# EAGLE design xwoofer (EAGLE 6.4)
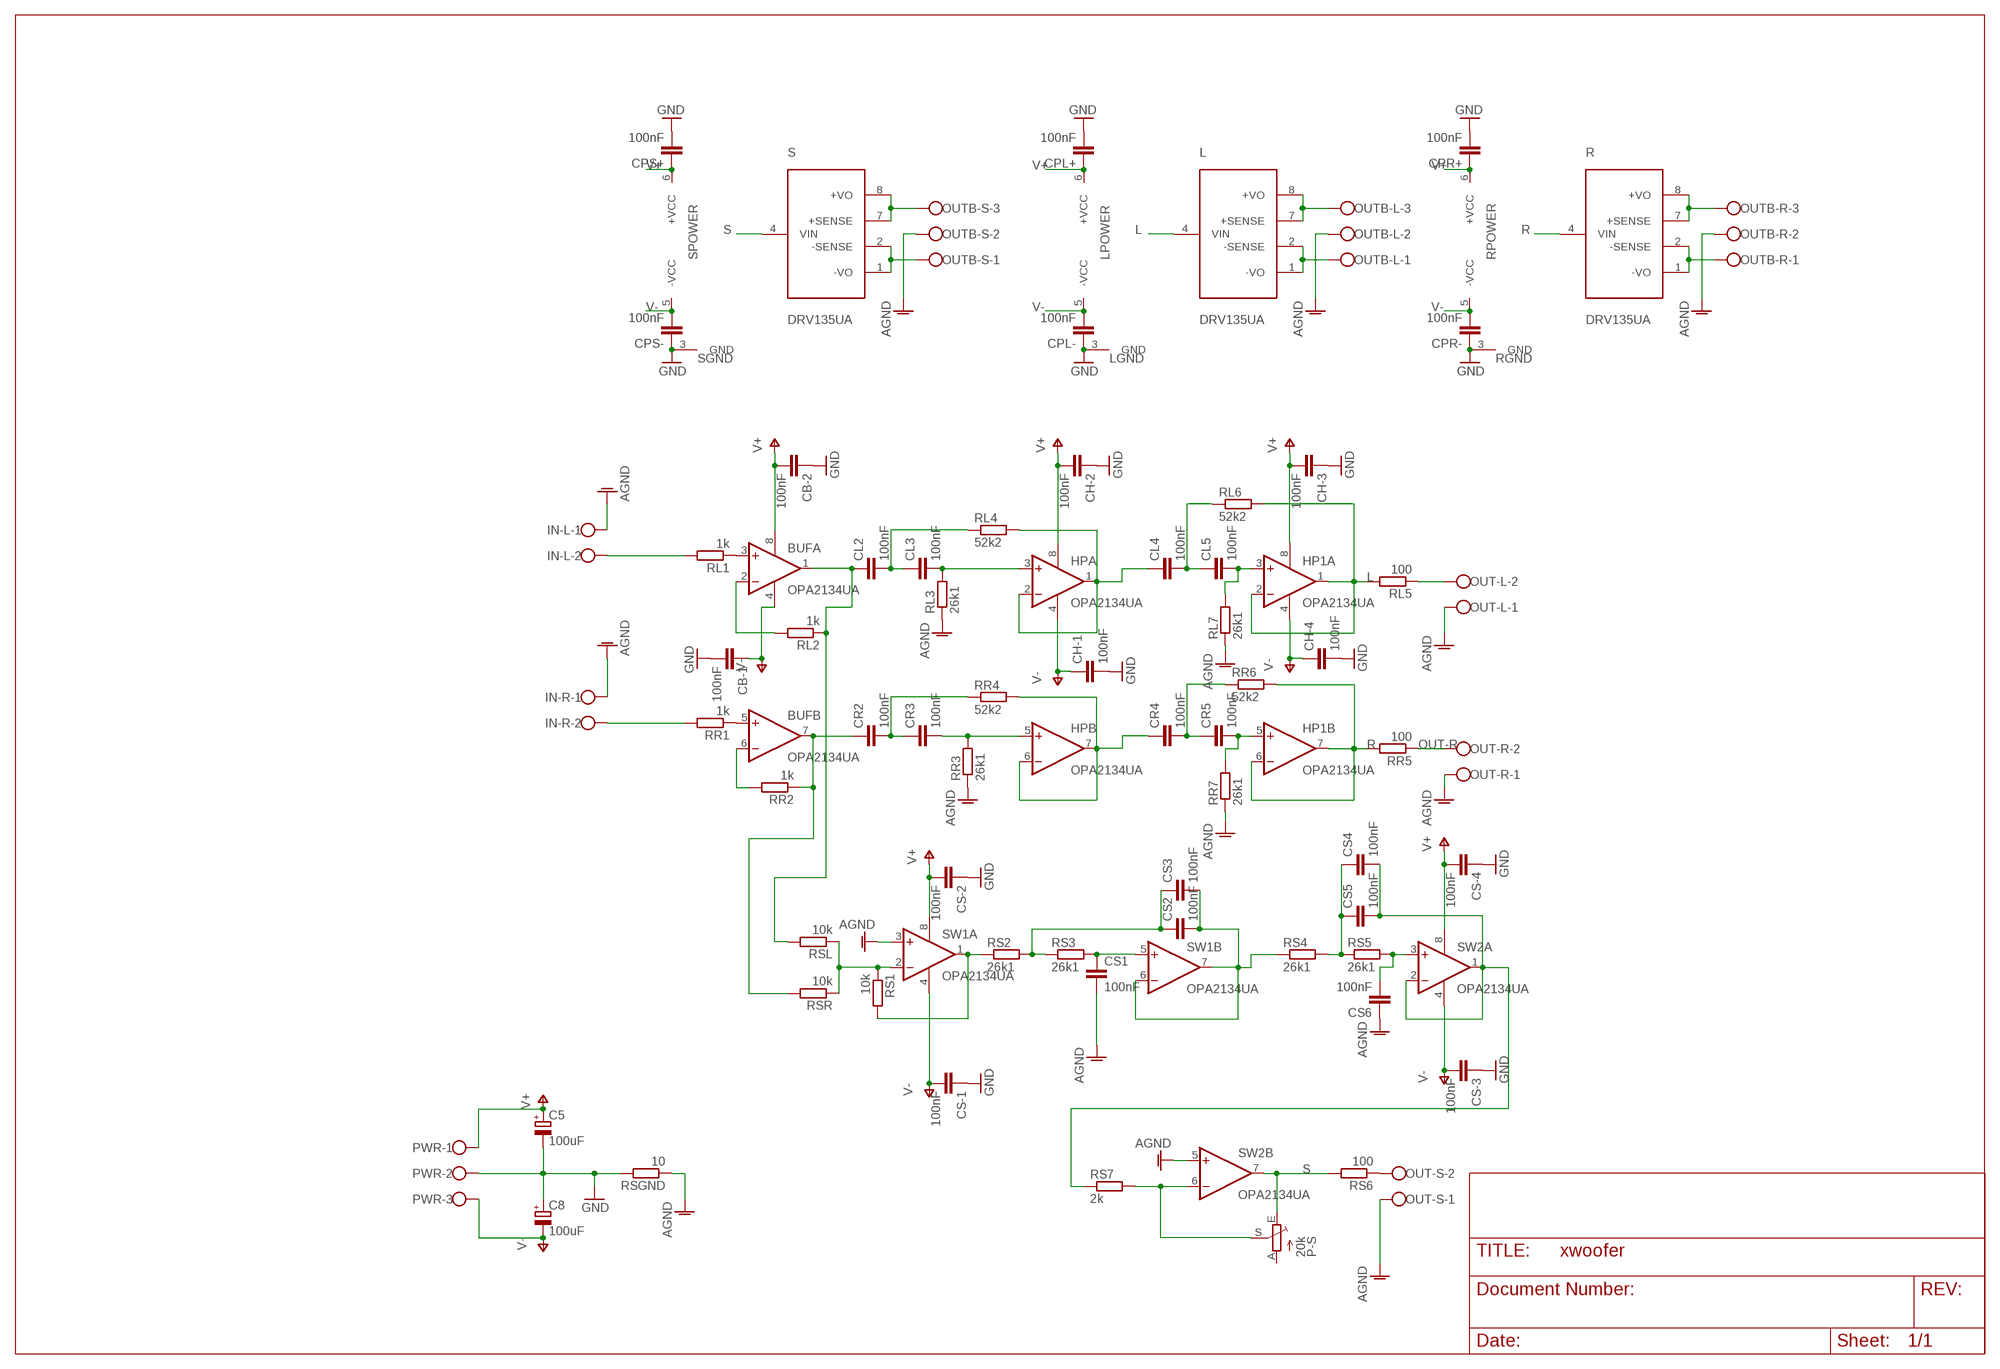
[diagram p0: schematic, sheet 1]

## Parts
BUF  OPA2134UA  [SO08]
C5  100uF  CPOL-EUE2.5-7  [E2,5-7]
C8  100uF  CPOL-EUE2.5-7  [E2,5-7]
CB-1  100nF  C-EUC0805  [C0805]
CB-2  100nF  C-EUC0805  [C0805]
CH-1  100nF  C-EUC0805K  [C0805K]
CH-2  100nF  C-EUC0805K  [C0805K]
CH-3  100nF  C-EUC0805K  [C0805K]
CH-4  100nF  C-EUC0805K  [C0805K]
CL2  100nF  C-EU025-025X050  [C025-025X050]
CL3  100nF  C-EU025-025X050  [C025-025X050]
CL4  100nF  C-EU025-025X050  [C025-025X050]
CL5  100nF  C-EU025-025X050  [C025-025X050]
CPL+  100nF  C-EUC0805K  [C0805K]
CPL-  100nF  C-EUC0805K  [C0805K]
CPR+  100nF  C-EUC0805K  [C0805K]
CPR-  100nF  C-EUC0805K  [C0805K]
CPS+  100nF  C-EUC0805K  [C0805K]
CPS-  100nF  C-EUC0805K  [C0805K]
CR2  100nF  C-EU025-025X050  [C025-025X050]
CR3  100nF  C-EU025-025X050  [C025-025X050]
CR4  100nF  C-EU025-025X050  [C025-025X050]
CR5  100nF  C-EU025-025X050  [C025-025X050]
CS1  100nF  C-EU025-025X050  [C025-025X050]
CS2  100nF  C-EU025-025X050  [C025-025X050]
CS3  100nF  C-EU025-025X050  [C025-025X050]
CS4  100nF  C-EU025-025X050  [C025-025X050]
CS5  100nF  C-EU025-025X050  [C025-025X050]
CS6  100nF  C-EU025-025X050  [C025-025X050]
CS-1  100nF  C-EUC0805K  [C0805K]
CS-2  100nF  C-EUC0805K  [C0805K]
CS-3  100nF  C-EUC0805K  [C0805K]
CS-4  100nF  C-EUC0805K  [C0805K]
HP  OPA2134UA  [SO08]
HP1  OPA2134UA  [SO08]
IN-L  W237-102  [W237-102]
IN-R  W237-102  [W237-102]
L  DRV135UA  [SO08]
OUT-L  W237-102  [W237-102]
OUT-R  W237-102  [W237-102]
OUT-S  W237-102  [W237-102]
OUTB-L  W237-103  [W237-103]
OUTB-R  W237-103  [W237-103]
OUTB-S  W237-103  [W237-103]
P-S  20k  TRIM_EU-B64Y  [B64Y]
PWR  W237-103  [W237-103]
R  DRV135UA  [SO08]
RL1  1k  R-EU_R0603  [R0603]
RL2  1k  R-EU_R0603  [R0603]
RL3  26k1  R-EU_R0603  [R0603]
RL4  52k2  R-EU_R0603  [R0603]
RL5  100  R-EU_R1206  [R1206]
RL6  52k2  R-EU_R0603  [R0603]
RL7  26k1  R-EU_R0603  [R0603]
RR1  1k  R-EU_R0603  [R0603]
RR2  1k  R-EU_R0603  [R0603]
RR3  26k1  R-EU_R0603  [R0603]
RR4  52k2  R-EU_R0603  [R0603]
RR5  100  R-EU_R1206  [R1206]
RR6  52k2  R-EU_R0603  [R0603]
RR7  26k1  R-EU_R0603  [R0603]
RS1  10k  R-EU_R0603  [R0603]
RS2  26k1  R-EU_R0603  [R0603]
RS3  26k1  R-EU_R0603  [R0603]
RS4  26k1  R-EU_R0603  [R0603]
RS5  26k1  R-EU_R0603  [R0603]
RS6  100  R-EU_R1206  [R1206]
RS7  2k  R-EU_R0603  [R0603]
RSGND  10  R-EU_R1206  [R1206]
RSL  10k  R-EU_R0603  [R0603]
RSR  10k  R-EU_R0603  [R0603]
S  DRV135UA  [SO08]
SW1  OPA2134UA  [SO08]
SW2  OPA2134UA  [SO08]

## Nets
AGND: CS1.2 CS6.1 IN-L.1 IN-R.1 OUT-L.1 OUT-R.1 OUT-S.1 OUTB-L.2 OUTB-R.2 OUTB-S.2 RL3.1 RL7.1 RR3.1 RR7.1 RSGND.1 SW1.3(A:+IN) SW2.5(B:+IN)
CL3: CL3.2 HP.3(A:+IN) RL3.2
GND: C5.- C8.+ CB-1.2 CB-2.1 CH-1.2 CH-2.1 CH-3.1 CH-4.2 CPL+.2 CPL-.1 CPR+.2 CPR-.1 CPS+.2 CPS-.1 CS-1.1 CS-2.1 CS-3.1 CS-4.1 L.3(GND) PWR.2 R.3(GND) RSGND.2 S.3(GND)
L: HP1.1(A:OUT) HP1.2(A:-IN) L.4(VIN) RL5.2 RL6.2
N$1: OUT-S.2 RS6.1
N$2: RS1.1 RSL.1 RSR.1 SW1.2(A:-IN)
N$3: RS1.2 RS2.1 SW1.1(A:OUT)
N$5: IN-L.2 RL1.2
N$6: IN-R.2 RR1.2
N$7: BUF.2(A:-IN) RL2.2
N$8: CL4.2 CL5.1 RL6.1
N$9: CL2.2 CL3.1 RL4.1
N$10: BUF.7(B:OUT) CR2.1 RR2.1 RSR.2
N$11: OUT-L.2 RL5.1
N$12: BUF.3(A:+IN) RL1.1
N$13: BUF.5(B:+IN) RR1.1
N$14: CS2.1 CS3.1 RS2.2 RS3.1
N$15: CL5.2 HP1.3(A:+IN) RL7.2
N$17: L.7(+SENSE) L.8(+VO) OUTB-L.3
N$18: CS1.1 RS3.2 SW1.5(B:+IN)
N$19: BUF.6(B:-IN) RR2.2
N$20: CR4.2 CR5.1 RR6.1
N$21: CS4.1 CS5.1 RS4.2 RS5.1
N$22: CR5.2 HP1.5(B:+IN) RR7.2
N$23: L.1(-VO) L.2(-SENSE) OUTB-L.1
N$24: OUTB-R.3 R.7(+SENSE) R.8(+VO)
N$26: CS4.2 CS5.2 RS7.1 SW2.1(A:OUT) SW2.2(A:-IN)
N$27: CS6.2 RS5.2 SW2.3(A:+IN)
N$29: CR3.2 HP.5(B:+IN) RR3.2
N$30: P-S.S RS7.2 SW2.6(B:-IN)
N$31: CL4.1 HP.1(A:OUT) HP.2(A:-IN) RL4.2
N$32: CR4.1 HP.6(B:-IN) HP.7(B:OUT) RR4.2
N$33: CR2.2 CR3.1 RR4.1
N$36: BUF.1(A:OUT) CL2.1 RL2.1 RSL.2
N$38: OUTB-R.1 R.1(-VO) R.2(-SENSE)
N$50: OUTB-S.3 S.7(+SENSE) S.8(+VO)
N$52: OUTB-S.1 S.1(-VO) S.2(-SENSE)
OUT-R: OUT-R.2 RR5.1
R: HP1.6(B:-IN) HP1.7(B:OUT) R.4(VIN) RR5.2 RR6.2
S: P-S.E RS6.2 S.4(VIN) SW2.7(B:OUT)
SF: CS2.2 CS3.2 RS4.1 SW1.6(B:-IN) SW1.7(B:OUT)
V+: BUF.8(A:V+) C5.+ CB-2.2 CH-2.2 CH-3.2 CPL+.1 CPR+.1 CPS+.1 CS-2.2 CS-4.2 HP1.8(A:V+) HP.8(A:V+) L.6(+VCC) PWR.1 R.6(+VCC) S.6(+VCC) SW1.8(A:V+) SW2.8(A:V+)
V-: BUF.4(A:V-) C8.- CB-1.1 CH-1.1 CH-4.1 CPL-.2 CPR-.2 CPS-.2 CS-1.2 CS-3.2 HP1.4(A:V-) HP.4(A:V-) L.5(-VCC) PWR.3 R.5(-VCC) S.5(-VCC) SW1.4(A:V-) SW2.4(A:V-)
Unconnected: P-S.A

## Library data of the parts
BUF HP HP1 SW1 SW2 = linear:OPA2*: Dual Operational Amplifier Low Power, Single-Supply, Rail-To-Rail Operational Amplifier Source: http://focus.ti.com/lit/ds/symlink/opa2345.pdf http://focus.ti.com .. opa241.pdf http://focus.ti.com/lit/ds/symlink/opa2134.pdf
C5 C8 = resistor:CPOL-EU: POLARIZED CAPACITOR, European symbol
CB-1 CB-2 CH-1-CH-4 CL2-CL5 CPL+ CPL- CPR+ CPR- CPS+ CPS- CR2-CR5 CS1-CS6 CS-1-CS-4 = rcl:C-EU: CAPACITOR, European symbol
IN-L IN-R OUT-L OUT-R OUT-S = con-wago-500:W237-102: WAGO SCREW CLAMP
L R S = BurrBrownAudioParts:DRV135: Audio Balanced Line Drivers
OUTB-L OUTB-R OUTB-S PWR = lars-eagle:W237-103: WAGO SCREW CLAMP; MPN: 237-103; OC_FARNELL: unknown; OC_NEWARK: 18M7116
P-S = pot:TRIM_EU-: POTENTIOMETER
RL1-RL7 RR1-RR7 RS1-RS7 RSGND RSL RSR = rcl:R-EU_: RESISTOR, European symbol

## Board
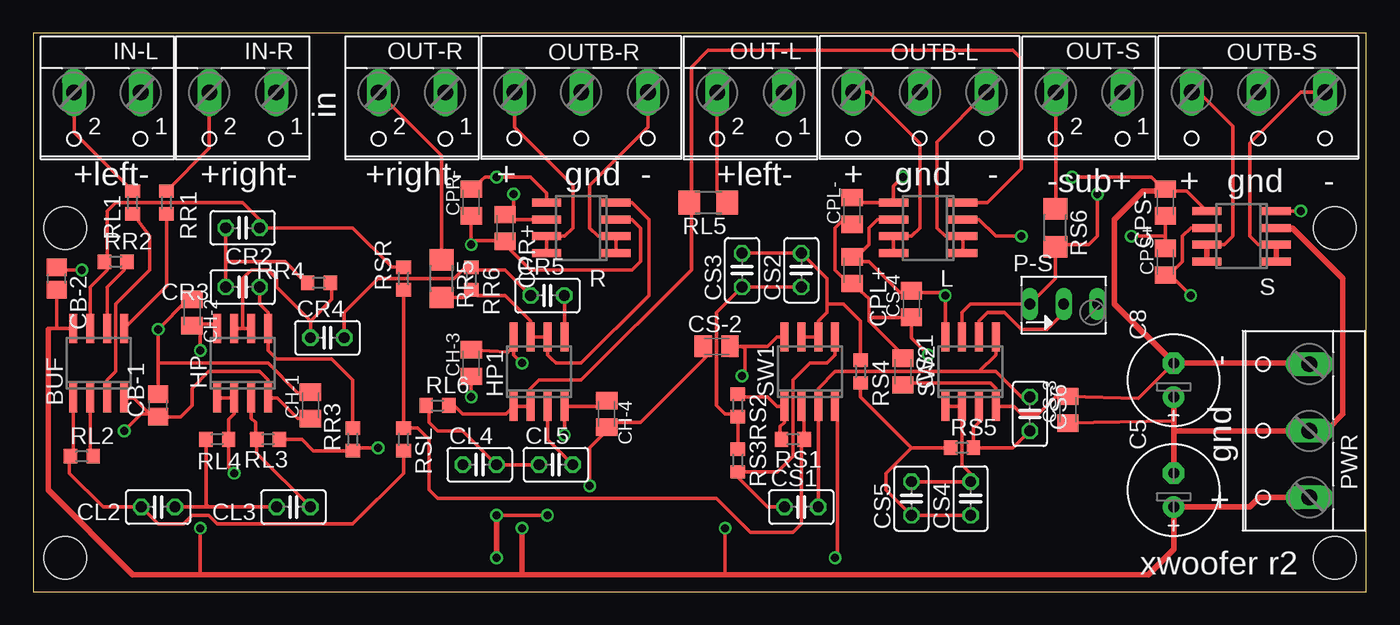
[diagram p1: board, top side]
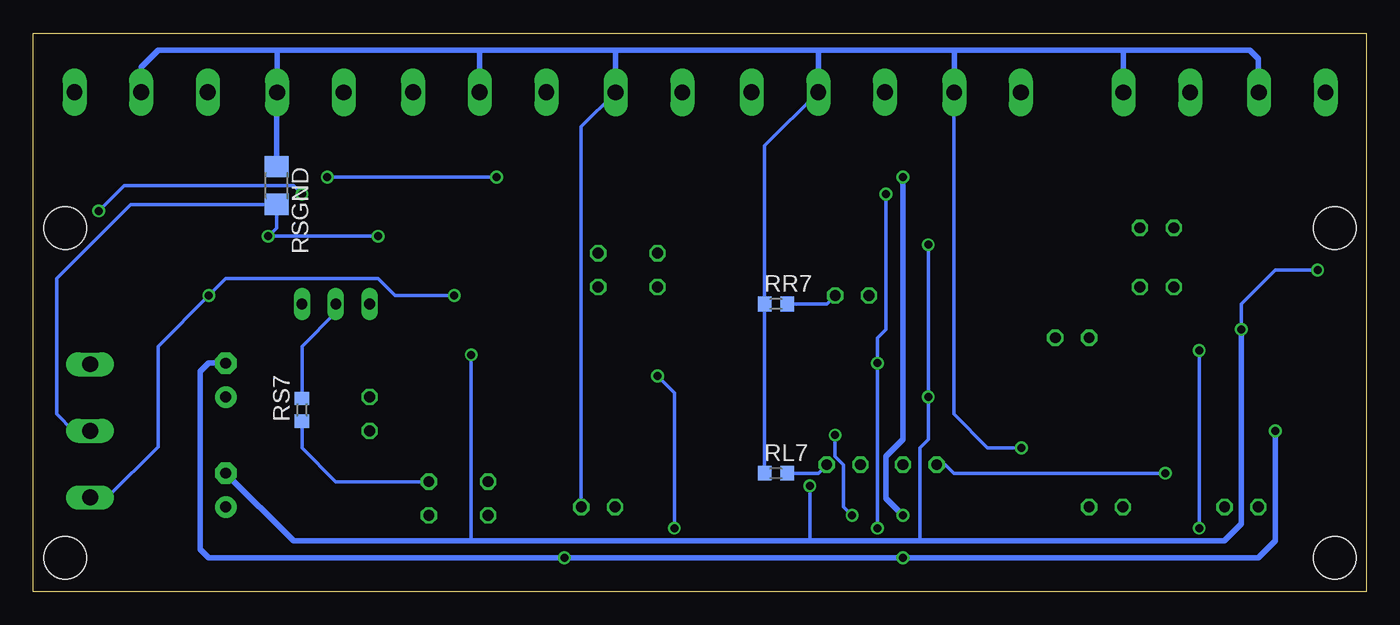
[diagram p2: board, bottom side, seen from below]

Size 100 x 41.9 mm. Coordinates in mm from the lower left corner, seen from the top.
Outline: 0,0 100,0 100,41.9 0,41.9 0,0
Copper layers (1*16): Top 0.0356mm / dielectric 1.5011mm / Bottom 0.0356mm
Design rules "LaenPCBOrder": minimum track width 6mil, minimum drill 13mil, track to track 6mil, track to pad 6mil, pad to pad 6mil, via to via 6mil, smd to smd 6mil, copper to edge 15mil, drill to drill 6mil, minimum pad ring 7mil, minimum via ring 7mil, stop-mask expansion 4mil, vias tented up to drill 0mil, thermal gap 10mil
Holes 3.2 mm at 2.38,27.3 2.38,2.54 97.62,2.54 97.62,27.3

### Footprints (pad centres in the part's own frame; a part is rotated, then mirrored left to right if it is on the bottom)
SO08 = smd 0.6 x 2.2: 1 -1.905,-2.6; 2 -0.635,-2.6; 3 0.635,-2.6; 4 1.905,-2.6; 5 1.905,2.6; 6 0.635,2.6; 7 -0.635,2.6; 8 -1.905,2.6
E2,5-7 = drill 0.813 pad 1.6: + -1.27,0 | drill 0.813 pad 1.6 octagon: - 1.27,0
C0805 = smd 1.3 x 1.5: 1 -0.85,0; 2 0.85,0
C0805K = smd 1.3 x 1.6: 1 -1,0; 2 1,0
C025-025X050 = drill 0.813 octagon: 1 -1.27,0; 2 1.27,0
W237-102 = drill 1.194 long: 1 -2.5,-1.27; 2 2.5,-1.27
W237-103 = drill 1.194 long: 1 -5,-1.29; 2 0,-1.29; 3 5,-1.29
B64Y = drill 0.813 long: A 2.54,0; E -2.54,0; S 0,0
R0603 = smd 1 x 1.1: 1 -0.85,0; 2 0.85,0
R1206 = smd 1.6 x 1.803: 1 -1.422,0; 2 1.422,0

### Placement (x,y rotation side)
BUF  4.92,17.14 0 top
C5  85.56,7.62 90 top
C8  85.56,15.87 90 top
CB-1  9.36,13.96 90 top
CB-2  1.74,23.49 270 top
CH-1  20.79,13.96 90 top
CH-2  11.9,20.95 270 top
CH-3  32.86,17.14 90 top
CH-4  43.02,13.33 270 top
CL2  9.36,6.34 0 top
CL3  19.52,6.34 0 top
CL4  33.49,9.52 0 top
CL5  39.2,9.52 0 top
CPL+  61.43,24.12 270 top
CPL-  61.43,28.57 90 top
CPR+  35.4,27.3 270 top
CPR-  32.86,29.21 90 top
CPS+  84.92,24.76 90 top
CPS-  84.92,29.21 90 top
CR2  15.71,27.3 180 top
CR3  15.71,22.86 0 top
CR4  22.06,19.05 0 top
CR5  38.57,22.22 0 top
CS1  57.62,6.34 0 top
CS2  57.62,24.12 90 top
CS3  53.18,24.12 90 top
CS4  70.32,6.98 90 top
CS5  65.88,6.98 90 top
CS6  74.77,13.33 270 top
CS-1  65.24,16.51 270 top
CS-2  51.27,18.41 0 top
CS-3  77.62,13.65 90 top
CS-4  65.88,21.59 90 top
HP  15.71,17.14 0 top
HP1  37.94,16.51 0 top
IN-L  5.55,36.19 180 top
IN-R  15.71,36.19 180 top
L  67.14,27.3 90 top
OUT-L  53.81,36.19 180 top
OUT-R  28.41,36.19 180 top
OUT-S  79.21,36.19 180 top
OUTB-L  66.51,36.19 180 top
OUTB-R  41.11,36.19 180 top
OUTB-S  91.91,36.19 180 top
P-S  77.3,21.59 0 top
PWR  94.45,12.06 90 top
R  41.11,27.3 90 top
RL1  7.46,29.21 90 top
RL2  3.65,10.15 0 top
RL3  17.62,11.42 180 top
RL4  13.81,11.42 0 top
RL5  50.63,29.21 180 top
RL6  30.32,13.96 0 top
RL7  44.29,8.88 0 bottom
RR1  10,29.21 90 top
RR2  6.18,24.76 0 top
RR3  23.96,11.42 90 top
RR4  21.43,23.17 0 top
RR5  30.63,23.49 270 top
RR6  32.86,23.49 270 top
RR7  44.29,21.59 0 bottom
RS1  56.98,11.42 180 top
RS2  52.86,13.96 270 top
RS3  52.86,9.84 270 top
RS4  62.06,16.51 270 top
RS5  69.68,10.79 0 top
RS6  76.67,27.3 270 top
RS7  79.84,13.65 90 bottom
RSGND  81.75,30.48 270 bottom
RSL  27.78,11.42 270 top
RSR  27.78,23.49 90 top
S  90.64,26.67 90 top
SW1  58.26,16.51 0 top
SW2  70.32,16.51 0 top

### Tracks (layer width: path | path; a pad name or v marks a point on that pad's centre or on a via)
AGND  (via drill 0.6)
  Top 0.254: RL3.1 20.16,11.42 21.01,10.57 RR3.1 24.18,10.79 v25.87,10.79 | CS1.2 SW1.3 58.89,15.23 60.16,16.51 70.95,16.51 | 70.95,16.51 72.22,17.78 SW2.5 | CS6.1 74.13,14.6 72.22,16.51 70.95,16.51
  Bottom 0.254: v25.87,10.79 28.41,10.79 30.95,13.33 30.95,37.42 OUT-R.1 | 44.92,8.88 RL7.1 RR7.1 45.13,33.45 OUTB-R.2 | CS1.2 58.89,34.88 OUT-L.1
  Bottom 0.406: OUTB-S.2 91.91,39.36 90.64,40.63 81.75,40.63 | 81.75,40.63 66.51,40.63 | 66.51,40.63 56.35,40.63 | 56.35,40.63 41.11,40.63 | OUTB-R.2 41.11,40.63 | OUT-L.1 56.31,40.59 56.35,40.63 | OUTB-L.2 66.51,40.63 | 81.75,40.63 81.71,40.59 OUT-S.1 81.75,37.42 RSGND.1 | 41.11,40.63 30.95,40.63 | 30.95,40.63 18.25,40.63 | 18.25,40.63 8.73,40.63 8.09,40 8.09,37.5 IN-L.1 | IN-R.1 18.21,40.59 18.25,40.63 | OUT-R.1 30.91,40.59 30.95,40.63
CL3
  Top 0.254: 16.35,11.84 RL3.2 | RL3.2 16.77,10.37 CL3.2 | HP.3 16.35,13.01 16.66,12.69 16.66,11.53 RL3.2
GND  (via drill 0.6)
  Top 0.254: 9.36,17.14 v9.36,19.68 11.48,21.8 CH-2.1 | 9.36,17.14 CB-1.2 | 20.79,15.23 CH-1.2 20.69,14.92 19.84,14.92 17.62,17.14 9.36,17.14 | CH-3.1 v32.86,14.6 | CPR-.1 v32.86,26.03 33.17,26.35 35.29,26.35 CPR+.2 35.4,26.03 37.3,24.12 44.92,24.12 45.55,24.76 45.55,27.3 44.92,27.94 R.3 | v41.74,7.93 41.74,10.79 43.02,12.06 CH-4.2 43.23,12.69 45.55,12.69 50.63,17.78 50.63,18.2 CS-2.1 50.42,18.2 | CPL-.1 60.58,27.72 60.16,27.3 60.16,24.12 60.8,23.49 61.22,23.49 CPL+.2 62.7,22.01 62.7,20.32 | L.3 70.95,27.94 72.22,26.67 v74.13,26.67 | 84.92,26.67 CPS-.1 84.71,28.36 | CS-1.1 65.24,17.78 62.7,20.32 | CS-3.1 85.46,12.8 85.56,12.69 | CPS+.2 84.92,26.67 | 84.92,26.67 v82.38,26.67 | v67.14,17.78 65.88,19.05 CS-4.1 62.97,20.59 62.7,20.32 | v3.65,24.12 1.96,24.12 CB-2.1
  Top 0.406: 85.56,12.06 PWR.2 96.99,12.06 98.26,13.33 98.26,23.49 94.45,27.3 S.3 | 85.56,12.06 C5.- | C8.+ 85.56,12.69 85.56,12.06
  Bottom 0.254: v9.36,19.68 9.36,21.59 6.82,24.12 v3.65,24.12 | v32.86,26.03 v32.86,14.6 32.86,11.42 33.49,10.79 33.49,3.81 | v41.74,7.93 41.74,3.81 | PWR.2 96.99,12.06 98.26,13.33 98.26,23.49 92.7,29.05 RSGND.2 81.75,27.3 v82.38,26.67 v74.13,26.67 | v67.14,17.78 67.14,3.81
  Bottom 0.406: v9.36,19.68 9.36,5.08 10.63,3.81 33.49,3.81 41.74,3.81 67.14,3.81 80.48,3.81 C5.-
L
  Top 0.254: L.4 71.59,29.21 74.13,31.75 74.13,40 73.49,40.63 50.63,40.63 49.37,39.36 49.37,29.36 | RL6.2 31.59,13.96 32.22,13.33 35.45,13.33 HP1.1 HP1.2 37.24,13.96 37.24,15.17 37.94,15.87 41.11,15.87 49.37,24.12 49.37,29.05 RL5.2
  Top 0.406: 49.37,29.36 RL5.2
N$1
  Top 0.254: OUT-S.2 76.71,28.76 RS6.1
N$2
  Top 0.254: RSR.1 RSL.1 28.83,12.27 29.68,11.42 29.68,7.62 30.32,6.98 51.27,6.98 53.81,4.44 56.98,4.44 57.62,5.08 57.62,11.21 RS1.1 57.84,13.69 SW1.2
N$3
  Top 0.254: RS2.1 53.07,14.6 55.08,14.6 55.77,13.9 SW1.1 56.35,12.69 56.03,12.38 56.03,11.53 RS1.2
N$5
  Top 0.254: IN-L.2 3.05,34.46 RL1.2
N$6
  Top 0.254: IN-R.2 13.21,33.27 RR1.2
N$7
  Top 0.254: BUF.2 4.28,10.37 RL2.2
N$8
  Top 0.254: CL5.1 CL4.2 32.22,12.06 30.32,12.06 29.68,12.69 29.68,13.75 RL6.1
N$9
  Top 0.254: CL3.1 13.17,6.34 | 13.17,6.34 CL2.2 | RL4.1 12.96,6.56 13.17,6.34
N$10
  Top 0.254: BUF.7 4.28,22.86 5.55,24.12 5.55,24.55 RR2.1 5.55,24.98 5.55,28.57 6.18,29.21 15.71,29.21 16.98,27.94 CR2.1 23.96,27.3 26.93,24.34 RSR.2
N$11
  Top 0.254: OUT-L.2 51.31,29.95 RL5.1
N$12
  Top 0.254: RL1.1 8.73,26.67 8.73,24.12 6.18,21.59 6.18,16.51 5.55,15.87 BUF.3
N$13
  Top 0.254: RR1.1 10,22.92 BUF.5
N$14
  Top 0.254: CS2.1 CS3.1 51.27,20.95 51.27,13.96 51.91,13.33 52.64,13.33 RS2.2 RS3.1
N$15
  Top 0.254: HP1.3 38.57,11.42 CL5.2
  Bottom 0.254: RL7.2 41.11,8.88 CL5.2
N$17
  Top 0.254: OUTB-L.3 62.68,37.48 66.51,33.65 66.51,27.3 65.88,26.67 L.7 L.8
N$18
  Top 0.254: CS1.1 55.08,6.34 52.86,8.57 RS3.2 55.82,8.99 56.98,10.15 56.98,15.87 58.26,17.14 59.52,17.14 60.16,17.78 SW1.5
N$19
  Top 0.254: BUF.6 5.55,22.86 6.82,24.12 6.82,24.55 RR2.2
N$20
  Top 0.254: CR4.2 23.33,20.95 25.87,23.49 31.59,23.49 32.44,24.34 RR6.1 33.07,24.12 35.4,24.12 CR5.1
N$21
  Top 0.254: CS4.1 CS5.1 63.97,7.62 63.97,8.88 65.88,10.79 | RS5.1 65.88,10.79 | 65.88,10.79 62.06,14.6 RS4.2
N$22
  Top 0.254: CR5.2 HP1.5
  Bottom 0.254: RR7.2 40.48,21.59 CR5.2
N$23
  Top 0.254: OUTB-L.1 67.78,33.75 67.78,27.3 68.41,26.67 L.2 L.1
N$24
  Top 0.254: R.8 R.7 39.84,26.67 40.48,27.3 40.48,30.48 36.11,34.84 OUTB-R.3
N$26
  Top 0.254: CS5.2 CS4.2 70.32,8.88 69.68,9.52 SW2.2 SW2.1
  Bottom 0.254: CS4.2 77.3,8.25 79.84,10.79 RS7.1
N$27
  Top 0.254: SW2.3 70.95,12.69 70.53,12.27 RS5.2 73.49,10.79 CS6.2
N$29
  Top 0.254: CR3.2 16.98,21.59 17.62,20.95 HP.5 17.62,18.09 18.25,17.46 22.38,17.46 23.96,15.87 RR3.2
N$30
  Top 0.254: P-S.S 77.3,20.95 76.03,19.68 74.13,19.68 72.86,20.95 71.59,20.95 70.95,20.32 SW2.6
  Bottom 0.254: RS7.2 79.84,18.41 77.3,20.95 P-S.S
N$31  (via drill 0.6)
  Top 0.254: HP.1 HP.2 15.08,13.33 14.66,12.91 RL4.2 14.66,9.3 v15.08,8.88
  Bottom 0.254: CL4.1 31.59,9.52 30.95,8.88 v15.08,8.88
N$32
  Top 0.254: HP.6 15.71,19.74 | 15.71,19.74 HP.7 | CR4.1 20.79,20.32 | 20.79,20.32 22.38,21.9 22.38,23.07 RR4.2 | 20.79,20.32 18.25,22.86 18.25,23.49 17.62,24.12 16.35,24.12 15.71,23.49 15.71,19.74
N$33
  Top 0.254: CR2.2 14.44,24.76 | 14.44,24.76 CR3.1 | RR4.1 20.47,23.17 18.89,24.76 14.44,24.76
N$36
  Top 0.254: BUF.1 3.01,10.37 RL2.1 2.69,10.05 2.69,8.88 5.23,6.34 CL2.1 9.36,5.08 11.27,5.08 11.9,5.71 13.17,5.71 13.81,5.08 23.96,5.08 27.78,8.88 RSL.2
N$38
  Top 0.254: OUTB-R.1 46.11,34.84 41.74,30.48 41.74,27.3 42.38,26.67 R.2 R.1
N$50
  Top 0.254: OUTB-S.3 87.44,37.48 90,34.92 90,26.67 89.37,26.03 S.7
  Top 0.406: S.7 S.8
N$52
  Top 0.254: OUTB-S.1 95.1,37.48 91.27,33.65 91.27,26.67 91.91,26.03 S.2
  Top 0.406: S.2 S.1
OUT-R
  Top 0.254: RR5.1 30.63,32.74 OUT-R.2
R
  Top 0.254: R.4 44.92,29.21 46.19,27.94 46.19,22.22 41.11,17.14 39.2,17.14 38.89,17.46 38.57,17.78 HP1.6 HP1.7 37.3,20.32 35.4,22.22 33.27,22.22 RR6.2 32.28,22.07 RR5.2
S  (via drill 0.6)
  Top 0.254: SW2.7 69.68,20.95 70.32,21.59 P-S.E 76.67,23.49 RS6.2 76.82,26.03 79.21,26.03 79.84,26.67 v79.84,29.84 | S.4 v95.08,28.57
  Bottom 0.254: v95.08,28.57 93.18,30.48 80.48,30.48 v79.84,29.84
SF
  Top 0.254: CS3.2 CS2.2 59.52,23.49 59.52,21.59 | 59.52,21.59 59.52,20.95 58.89,20.32 SW1.6 SW1.7 | RS4.1 62.06,20.32 60.8,21.59 59.52,21.59
V+  (via drill 0.6)
  Top 0.254: BUF.8 1.74,19.74 | 1.74,19.74 1.17,19.74 1.1,19.68 | R.6 35.61,27.94 CPR+.1 36.03,28.79 v36.03,29.84 | CH-2.2 12.54,20.1 | 12.54,20.1 13.45,20.1 HP.8 | v12.54,4.76 12.54,1.27 | 36.03,18.41 HP1.8 | v51.91,4.76 51.91,1.27 | CH-3.2 35.61,17.99 36.03,18.41 | v36.66,17.14 36.03,17.78 36.03,18.41 | L.6 63.34,27.94 62.7,27.3 62.7,26.03 61.65,24.98 CPL+.1 61.65,24.76 62.7,24.76 65.02,22.44 CS-4.2 66.02,22.44 68.2,22.44 v68.41,22.22 SW2.8 | SW1.8 55.77,19.11 55.08,18.41 53.18,18.41 | CPS+.1 85.34,23.91 | 85.34,23.91 86.19,24.76 86.19,26.67 86.83,27.3 S.6 | 85.34,23.91 85.34,23.71 v86.83,22.22 | v53.18,16.19 53.39,16.4 53.39,18.2 53.18,18.41 | CS-2.2 53.18,18.41 | v12.54,18.09 12.54,20.1 | CB-2.2 1.74,19.74
  Top 0.406: PWR.1 91.99,7.06 91.27,6.34 C5.+ 85.56,3.17 83.65,1.27 51.91,1.27 36.66,1.27 | 36.66,1.27 12.54,1.27 7.46,1.27 1.1,7.62 1.1,19.68 | v36.66,4.76 36.66,1.27
  Bottom 0.254: v12.54,18.09 v12.54,4.76 | v36.66,4.76 v36.66,17.14 36.66,19.05 36.03,19.68 v36.03,29.84 | PWR.1 94.45,7.06 90.64,10.87 90.64,18.41 v86.83,22.22 85.56,23.49 74.13,23.49 72.86,22.22 v68.41,22.22 | v51.91,4.76 51.91,14.92 v53.18,16.19
V-  (via drill 0.6)
  Top 0.254: BUF.4 7.51,14.54 8.73,13.33 | 8.73,13.33 9.15,13.33 CB-1.1 11.05,13.11 11.9,13.96 11.9,15.23 13.17,16.51 16.98,16.51 17.62,15.87 HP.4 18.31,14.54 19.84,13.01 20.69,13.01 CH-1.1 | 8.73,13.33 8.09,13.33 v6.82,12.06 | R.5 38.51,29.9 37.3,31.11 v34.76,31.11 33.91,31.11 CPR-.2 | CH-4.1 42.74,13.9 HP1.4 v39.84,11.74 | v38.57,5.71 v34.76,5.71 | SW1.4 60.31,13.9 60.31,2.69 v60.16,2.54 | L.5 64.6,29.21 | C8.- 82.92,14.5 CS-3.2 77.52,14.6 76.67,14.6 75.4,13.33 74.13,13.33 73.55,13.9 SW2.4 72.22,15.23 71.8,15.65 65.39,15.65 CS-1.2 | S.5 86.55,30.05 85.07,30.05 CPS-.2 | L.5 64.54,30.42 v65.24,31.11 | v77.94,31.11 83.87,31.11 84.77,30.21 CPS-.2 | L.5 61.8,29.21 CPL-.2 | 84.77,30.05 CPS-.2
  Top 0.406: PWR.3 95.66,17.14 C8.- 81.11,21.59 81.11,27.94 83.23,30.05 84.77,30.05 | v34.76,2.54 v34.76,5.71
  Bottom 0.254: v39.84,11.74 39.84,10.15 39.2,9.52 39.2,6.34 v38.57,5.71 | v65.24,31.11 v77.94,31.11
  Bottom 0.406: C8.- 86.83,17.14 87.46,16.51 87.46,3.17 86.83,2.54 v60.16,2.54 v34.76,2.54 8.09,2.54 6.82,3.81 v6.82,12.06 | v34.76,31.11 34.76,11.42 36.03,10.15 36.03,6.98 v34.76,5.71

### Text on the board
tNames: in | -sub+ | + | gnd | - | +left- | +right- | +right- | + | gnd | - | +left- | + | gnd | - | - | gnd | + | xwoofer r2